# Altium schematic sheet Bank1_DDR.SchDoc
size A3
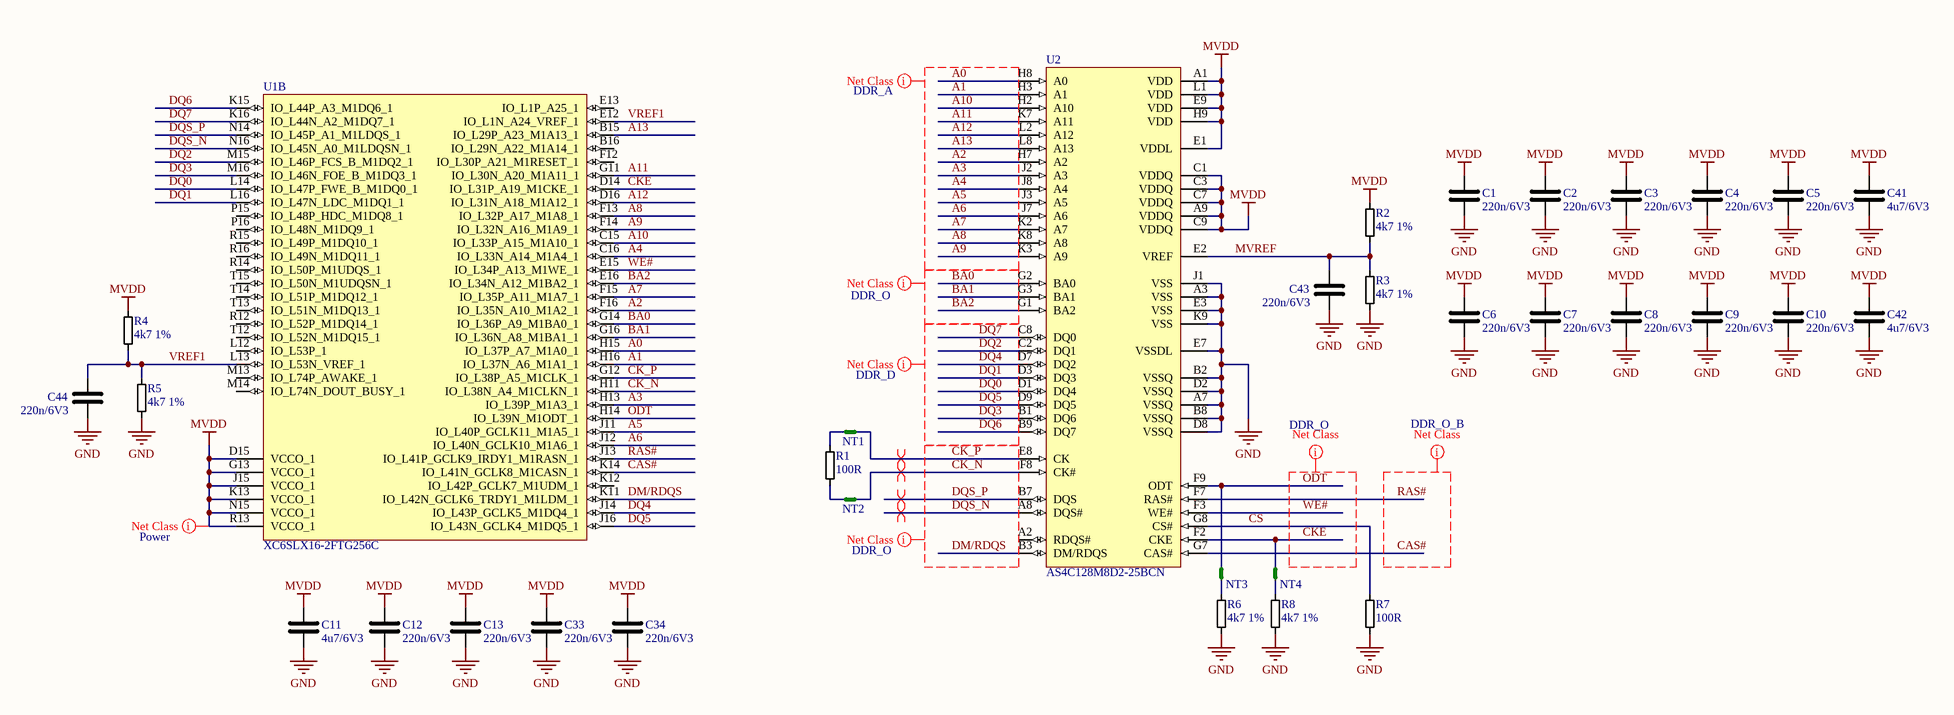
[diagram p0: Bank1_DDR.SchDoc]

## Parts
C1  220n/6V3  [C0402_N]
C2  220n/6V3  [C0402_N]
C3  220n/6V3  [C0402_N]
C4  220n/6V3  [C0402_N]
C5  220n/6V3  [C0402_N]
C6  220n/6V3  [C0402_N]
C7  220n/6V3  [C0402_N]
C8  220n/6V3  [C0402_N]
C9  220n/6V3  [C0402_N]
C10  220n/6V3  [C0402_N]
C11  4u7/6V3  [C0805_N]
C12  220n/6V3  [C0402_N]
C13  220n/6V3  [C0402_N]
C33  220n/6V3  [C0402_N]
C34  220n/6V3  [C0402_N]
C41  4u7/6V3  [C0805_N]
C42  4u7/6V3  [C0805_N]
C43  220n/6V3  [C0402_N]
C44  220n/6V3  [C0402_N]
NT1  NET TIE  [NET_TIE_5MIL_2]  (value not drawn)  (net tie, no BOM)
NT2  NET TIE  [NET_TIE_5MIL_2]  (value not drawn)  (net tie, no BOM)
NT3  NET TIE  [NET_TIE_5MIL_2]  (value not drawn)  (net tie, no BOM)
NT4  NET TIE  [NET_TIE_5MIL_2]  (value not drawn)  (net tie, no BOM)
R1  100R  [R0402_N]
R2  4k7 1%  [R0402_N]
R3  4k7 1%  [R0402_N]
R4  4k7 1%  [R0402_N]
R5  4k7 1%  [R0402_N]
R6  4k7 1%  [R0402_N]
R7  100R  [R0402_N]
R8  4k7 1%  [R0402_N]
U1  XC6SLX16-2FTG256C  [Xilinx_FT256_L]  (part B of 5)
U2  AS4C128M8D2-25BCN  [Alliance_FBGA60]

## Nets
GND: C1.1 C2.1 C3.1 C4.1 C5.1 C6.1 C7.1 C8.1 C9.1 C10.1 C11.1 C12.1 C13.1 C33.1 C34.1 C41.1 C42.1 C43.1 C44.1 R3.2 R5.2 R6.2 R7.2 R8.2 U2.A3(VSS) U2.A7(VSSQ) U2.B2(VSSQ) U2.B8(VSSQ) U2.D2(VSSQ) U2.D8(VSSQ) U2.E3(VSS) U2.E7(VSSDL) U2.J1(VSS) U2.K9(VSS)
MVDD: C1.2 C2.2 C3.2 C4.2 C5.2 C6.2 C7.2 C8.2 C9.2 C10.2 C11.2 C12.2 C13.2 C33.2 C34.2 C41.2 C42.2 R2.1 R4.1 U1.D15(VCCO_1) U1.G13(VCCO_1) U1.J15(VCCO_1) U1.K13(VCCO_1) U1.N15(VCCO_1) U1.R13(VCCO_1) U2.A1(VDD) U2.A9(VDDQ) U2.C1(VDDQ) U2.C3(VDDQ) U2.C7(VDDQ) U2.C9(VDDQ) U2.E1(VDDL) U2.E9(VDD) U2.H9(VDD) U2.L1(VDD)
A0: U1.H15(IO_L37P_A7_M1A0_1) U2.H8(A0)
A1: U1.H16(IO_L37N_A6_M1A1_1) U2.H3(A1)
A2: U1.F16(IO_L35N_A10_M1A2_1) U2.H7(A2)
A3: U1.H13(IO_L39P_M1A3_1) U2.J2(A3)
A4: U1.C16(IO_L33N_A14_M1A4_1) U2.J8(A4)
A5: U1.J11(IO_L40P_GCLK11_M1A5_1) U2.J3(A5)
A6: U1.J12(IO_L40N_GCLK10_M1A6_1) U2.J7(A6)
A7: U1.F15(IO_L35P_A11_M1A7_1) U2.K2(A7)
A8: U1.F13(IO_L32P_A17_M1A8_1) U2.K8(A8)
A9: U1.F14(IO_L32N_A16_M1A9_1) U2.K3(A9)
A10: U1.C15(IO_L33P_A15_M1A10_1) U2.H2(A10)
A11: U1.G11(IO_L30N_A20_M1A11_1) U2.K7(A11)
A12: U1.D16(IO_L31N_A18_M1A12_1) U2.L2(A12)
A13: U1.B15(IO_L29P_A23_M1A13_1) U2.L8(A13)
BA0: U1.G14(IO_L36P_A9_M1BA0_1) U2.G2(BA0)
BA1: U1.G16(IO_L36N_A8_M1BA1_1) U2.G3(BA1)
BA2: U1.E16(IO_L34N_A12_M1BA2_1) U2.G1(BA2)
CAS#: U1.K14(IO_L41N_GCLK8_M1CASN_1) U2.G7(CAS#)
CK_N: NT2.2 U1.H11(IO_L38N_A4_M1CLKN_1) U2.F8(CK#)
CK_P: NT1.2 U1.G12(IO_L38P_A5_M1CLK_1) U2.E8(CK)
CKE: NT4.2 U1.D14(IO_L31P_A19_M1CKE_1) U2.F2(CKE)
CS: R7.1 U2.G8(CS#)
DM/RDQS: U1.K11(IO_L42N_GCLK6_TRDY1_M1LDM_1) U2.B3(DM/RDQS)
DQ0: U1.L14(IO_L47P_FWE_B_M1DQ0_1) U2.D1(DQ4)
DQ1: U1.L16(IO_L47N_LDC_M1DQ1_1) U2.D3(DQ3)
DQ2: U1.M15(IO_L46P_FCS_B_M1DQ2_1) U2.C2(DQ1)
DQ3: U1.M16(IO_L46N_FOE_B_M1DQ3_1) U2.B1(DQ6)
DQ4: U1.J14(IO_L43P_GCLK5_M1DQ4_1) U2.D7(DQ2)
DQ5: U1.J16(IO_L43N_GCLK4_M1DQ5_1) U2.D9(DQ5)
DQ6: U1.K15(IO_L44P_A3_M1DQ6_1) U2.B9(DQ7)
DQ7: U1.K16(IO_L44N_A2_M1DQ7_1) U2.C8(DQ0)
DQS_N: U1.N16(IO_L45N_A0_M1LDQSN_1) U2.A8(DQS#)
DQS_P: U1.N14(IO_L45P_A1_M1LDQS_1) U2.B7(DQS)
MVREF: C43.2 R2.2 R3.1 U2.E2(VREF)
ODT: NT3.2 U1.H14(IO_L39N_M1ODT_1) U2.F9(ODT)
RAS#: U1.J13(IO_L41P_GCLK9_IRDY1_M1RASN_1) U2.F7(RAS#)
VREF1: C44.2 R4.2 R5.1 U1.E12(IO_L1N_A24_VREF_1) U1.L13(IO_L53N_VREF_1)
WE#: U1.E15(IO_L34P_A13_M1WE_1) U2.F3(WE#)
NetNT1_1: NT1.1 R1.1
NetNT2_1: NT2.1 R1.2
NetNT3_1: NT3.1 R6.1
NetNT4_1: NT4.1 R8.1

Not connected (* = marked no-connect by the designer): U1 B16(IO_L29N_A22_M1A14_1) E13(IO_L1P_A25_1) F12(IO_L30P_A21_M1RESET_1) K12(IO_L42P_GCLK7_M1UDM_1) L12(IO_L53P_1) M13(IO_L74P_AWAKE_1) M14(IO_L74N_DOUT_BUSY_1) P15(IO_L48P_HDC_M1DQ8_1) P16(IO_L48N_M1DQ9_1) R12(IO_L52P_M1DQ14_1) R14(IO_L50P_M1UDQS_1) R15(IO_L49P_M1DQ10_1) R16(IO_L49N_M1DQ11_1) T12(IO_L52N_M1DQ15_1) T13(IO_L51N_M1DQ13_1) T14(IO_L51P_M1DQ12_1) T15(IO_L50N_M1UDQSN_1); U2 A2(RDQS#)

## Layout directives
net class DDR_A: A0, A1, A2, A3, A4, A5, A6, A7, A8, A9, A10, A11, A12, A13
net class DDR_D: DQ0, DQ1, DQ2, DQ3, DQ4, DQ5, DQ6, DQ7
net class DDR_O: BA0, BA1, BA2, CK_N, CK_P, CKE, DM/RDQS, DQS_N, DQS_P, ODT, WE#
differential pair: CK_N, CK_P, DQS_N, DQS_P
net class Power: MVDD
net class DDR_O_B: CAS#, RAS#

## Library data of the parts
C1-C13 C33 C34 C41-C44 = C
R1-R8 = R